# Altium schematic sheet 09 USB HUB.SchDoc
size A3; SheetNumber: 5; SheetTotal: 10
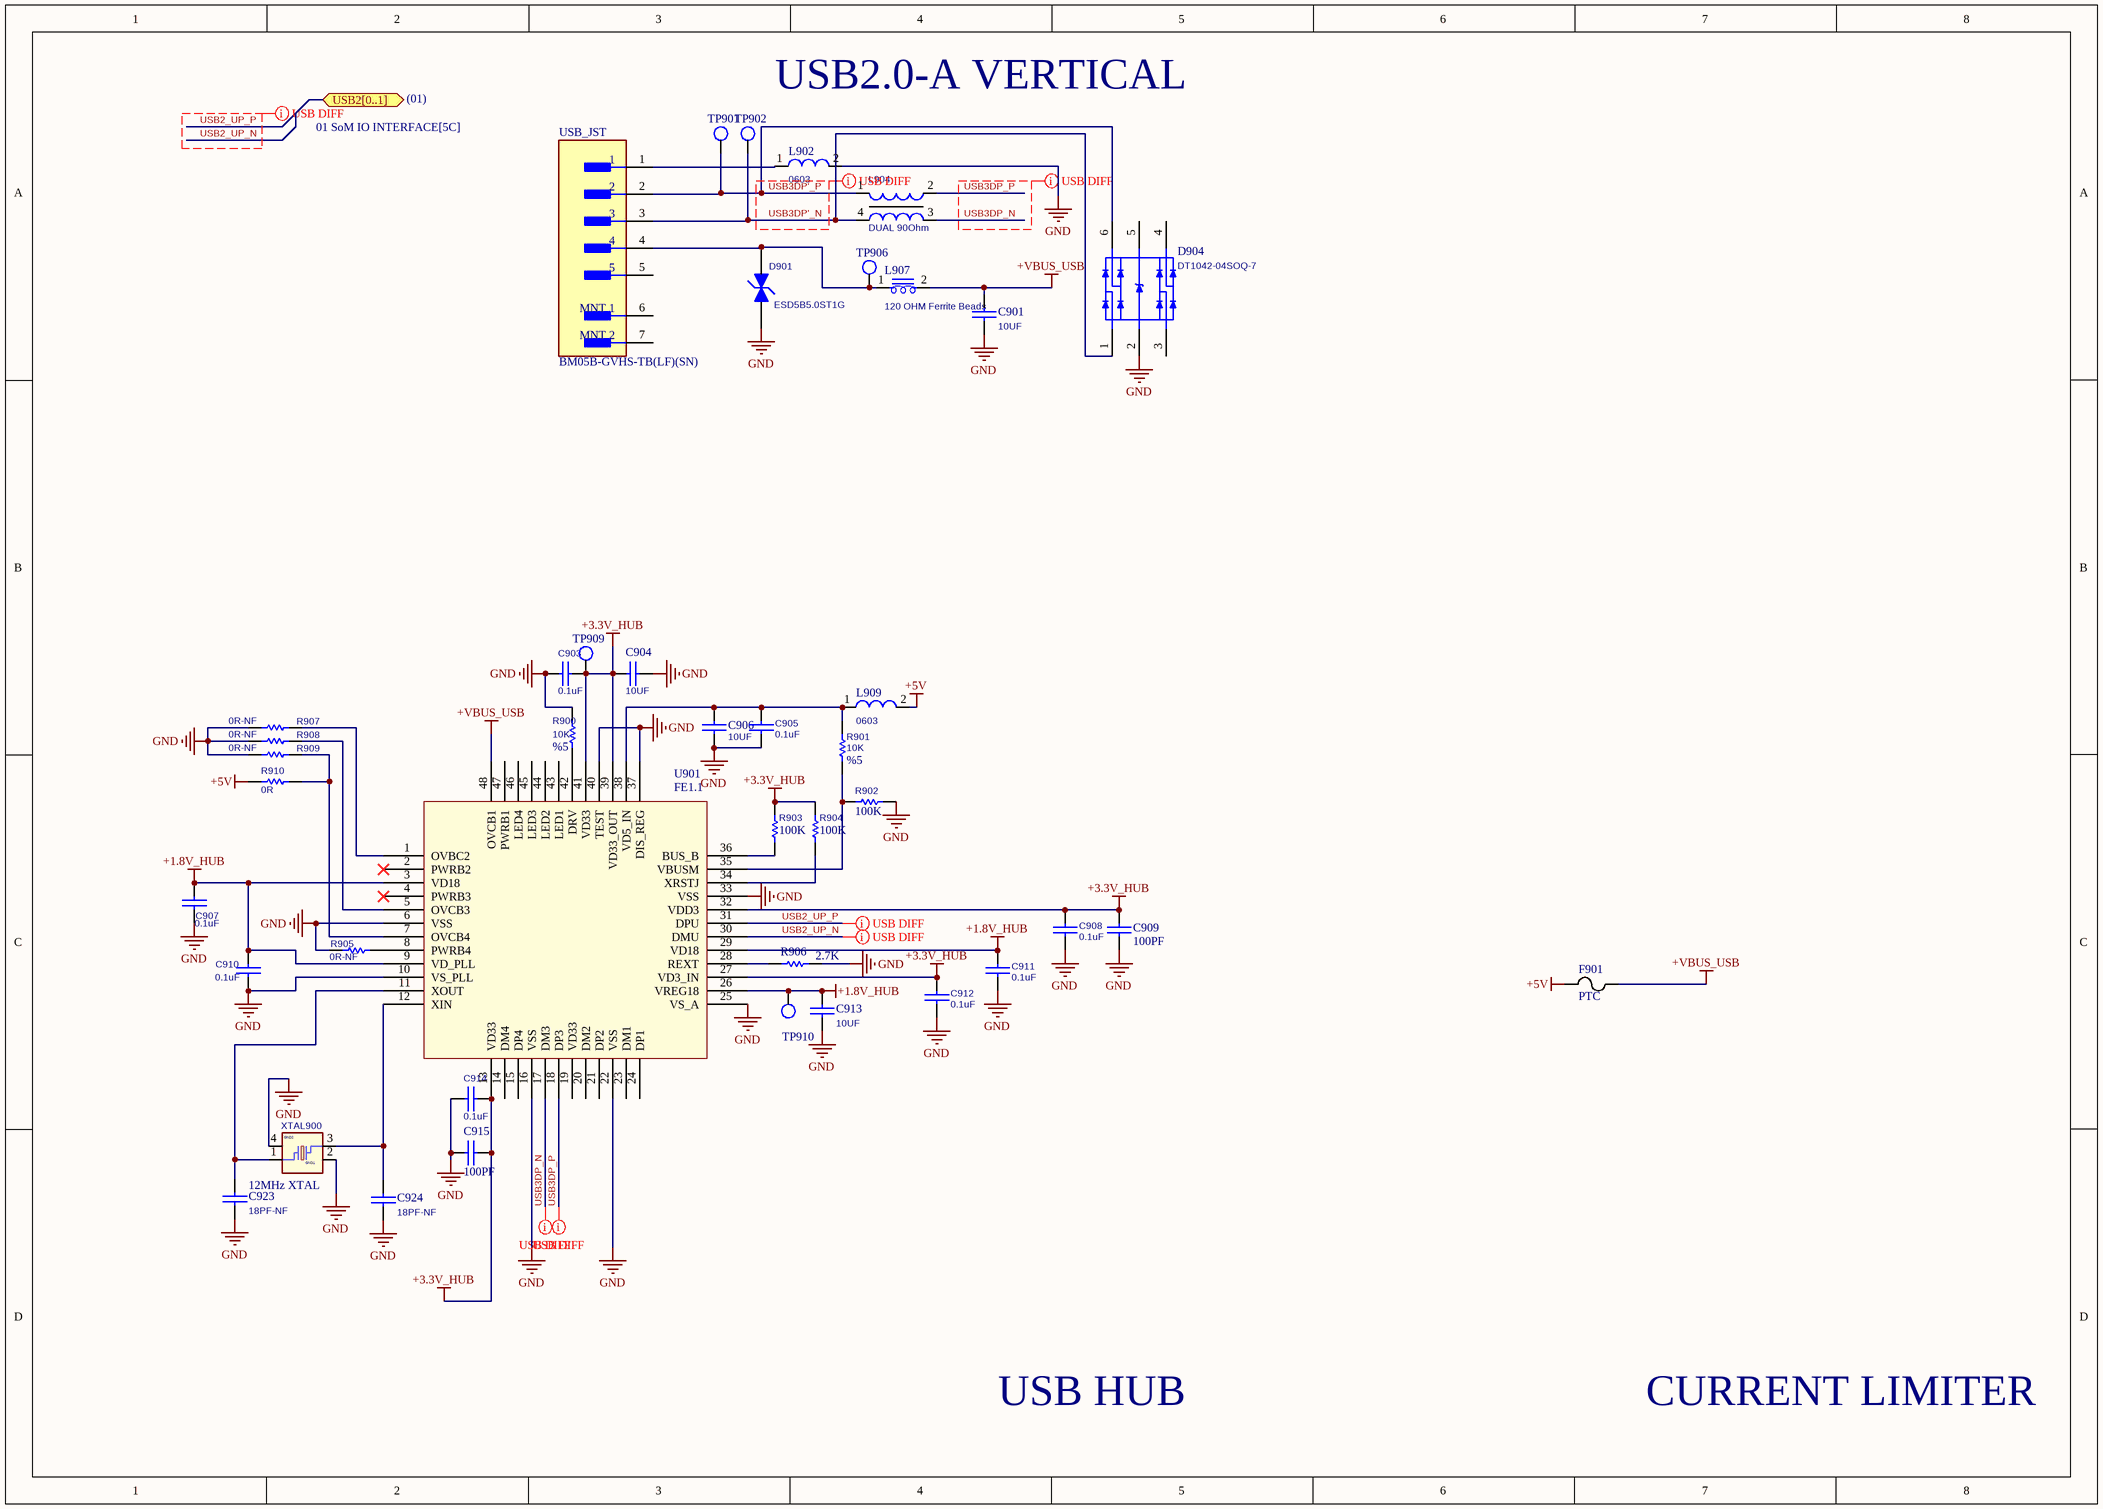
[diagram p0: 09 USB HUB.SchDoc]

## Parts
C901  10UF  [0805]
C903  0.1uF  [0402_CC]
C904  10UF  [0805]
C905  0.1uF  [0402_CC]
C906  10UF  [0805]
C907  0.1uF  [0402_CC]
C908  0.1uF  [0402_CC]
C909  100PF  [0402_CC]
C910  0.1uF  [0402_CC]
C911  0.1uF  [0402_CC]
C912  0.1uF  [0402_CC]
C913  10UF  [0805]
C914  0.1uF  [0402_CC]
C915  100PF  [0402_CC]
C923  18PF-NF  [0402_CC]  (no BOM)
C924  18PF-NF  [0402_CC]  (no BOM)
D901  ESD5B5.0ST1G  [SOD523 - SZESD]
D904  DT1042-04SOQ-7  [DIODE-DT1042-04SOQ-7]
F901  PTC  [1812]
L902  0603  [0603_RES]
L904  DUAL 90Ohm  [DLW21H]
L907  120 OHM Ferrite Beads  [0603_RES]
L909  0603  [0603_RES]
R900  10K  Tolerance: %5  [0402_RES]
R901  10K  Tolerance: %5  [0402_RES]
R902  100K  [0402_RES]
R903  100K  [0402_RES]
R904  100K  [0402_RES]
R905  0R-NF  [0402_RES]  (no BOM)
R906  2.7K  [0402_RES]
R907  0R-NF  [0402_RES]  (no BOM)
R908  0R-NF  [0402_RES]  (no BOM)
R909  0R-NF  [0402_RES]  (no BOM)
R910  0R  [0402_RES]
TP901  TEST POINT 15  [testpoint_15]  (value not drawn)  (no BOM)
TP902  TEST POINT 15  [testpoint_15]  (value not drawn)  (no BOM)
TP906  TEST POINT 15  [testpoint_15]  (value not drawn)  (no BOM)
TP909  TEST POINT 15  [testpoint_15]  (value not drawn)  (no BOM)
TP910  TEST POINT 15  [testpoint_15]  (value not drawn)  (no BOM)
U901  FE1.1  [LQFP48]
USB_JST  BM05B-GVHS-TB(LF)(SN)  [FP-BM05B-GVHS-TB_LF_SN-MFG]
XTAL900  CRYSTAL 12.MHZ 18PF SMD  [XTLOSC4_3P2X2P5MM_SM]  (value not drawn)

## Ports
USB2[0..1] (bidir, see 01 SoM IO INTERFACE[5C])

## Nets
+1.8V_HUB: C907.1 C910.1 C911.2 C913.1 TP910.1 U901.3(VD18) U901.9(VD_PLL) U901.26(VREG18) U901.29(VD18)
+3.3V_HUB: C903.1 C904.1 C908.2 C909.2 C912.2 C914.2 C915.2 R903.2 R904.2 TP909.1 U901.13(VD33) U901.27(VD3_IN) U901.32(VDD3) U901.39(VD33_OUT) U901.41(VD33)
+5V: F901.1 L909.2 R910.2
+VBUS_USB: C901.1 F901.2 L907.2 U901.48(OVCB1)
GND: C901.2 C903.2 C904.2 C905.1 C906.1 C907.2 C908.1 C909.1 C910.2 C911.1 C912.1 C913.2 C914.1 C915.1 C923.2 C924.2 D901.1(A) D904.2(VSS) L902.2 R900.1 R902.1 R905.1 R906.2 R907.1 R908.1 R909.1 U901.6(VSS) U901.10(VS_PLL) U901.16(VSS) U901.22(VSS) U901.25(VS_A) U901.33(VSS) U901.37(DIS_REG) U901.40(TEST) XTAL900.2(GND1) XTAL900.4(GND2)
USB2_UP_N: U901.30(DMU)
USB2_UP_P: U901.31(DPU)
USB3DP'_N: D904.1(IO1) L904.4 TP902.1 USB_JST.3
USB3DP'_P: D904.6(IO4) L904.1 TP901.1 USB_JST.2
USB3DP_N: L904.3 U901.17(DM3)
USB3DP_P: L904.2 U901.18(DP3)
NetC905_2: C905.2 C906.2 L909.1 R901.2 U901.38(VD5_IN)
NetC923_1: C923.1 U901.11(XOUT) XTAL900.1
NetC924_1: C924.1 U901.12(XIN) XTAL900.3
NetD901_2: D901.2(K) L907.1 TP906.1 USB_JST.4
NetL902_1: L902.1 USB_JST.1
NetR900_2: R900.2 U901.42(DRV)
NetR901_1: R901.1 R902.2 U901.35(VBUSM)
NetR903_1: R903.1 U901.36(BUS_B)
NetR904_1: R904.1 U901.34(XRSTJ)
NetR905_2: R905.2 U901.8(PWRB4)
NetR906_1: R906.1 U901.28(REXT)
NetR907_2: R907.2 U901.1(OVBC2)
NetR908_2: R908.2 U901.5(OVCB3)
NetR909_2: R909.2 R910.1 U901.7(OVCB4)

Not connected (* = marked no-connect by the designer): D904 3(IO2) 4(IO3) 5(VCC); U901 2(PWRB2)* 4(PWRB3)* 14(DM4) 15(DP4) 19(VD33) 20(DM2) 21(DP2) 23(DM1) 24(DP1) 43(LED1) 44(LED2) 45(LED3) 46(LED4) 47(PWRB1); USB_JST 5 6(MNT_1) 7(MNT_2)

## Layout directives
differential pair; differential pair class USB 90 OHM DIFF; net class USB: USB2_UP_N, USB2_UP_P, USB3DP'_N, USB3DP'_P, USB3DP_N, USB3DP_P
differential pair; differential pair class USB 90 OHM DIFF; net class USB; net class USB: USB3DP_N, USB3DP_P

## Notes on the sheet
- (01)
- USB2.0-A VERTICAL
- 12MHz XTAL
- USB HUB
- CURRENT LIMITER
- Sheet Title:
- Inventron
- Size:
- Drawn By:
- Revision:
- Project:
- Checked By:
- A4
- Sheet
- of
- Budotek Teknopark
- Dudullu OSB
- Des 2. Cadde No:8/30
- Umraniye / ISTANBUL
- Electronics and Software
- Date:
- Time:
- ©2020 Inventron Electronics and Software. All rights reserved.

## Library data of the parts
C901 C904 C906 C913 = CAP-CL21A106KOQNNNG: CAP CER 10UF 16V X5R 0805; Manufacturer-1: SAMSUNG; Class: Capacitor; Manufacturer Part Number-1: CL21A106KOQNNNG; Footprint: *; Manufacturer-2: *; Manufacturer Part Number-2: *; Inventron Stock No: *; Created By: EE; Created Date: *; Checked By: *; ASSY_OPT: *; Dimensions: *; Unit Price: 0.01876; Revision Date/Note: *; Price Break: 3000; Opt. Temp.: *; Features: *
C903 C905 C907 C908 C910-C912 C914 = CAP-CL05B104KO5NNNC: CAP VER 0.1UF 16V X7R 0402; Manufacturer-1: SAMSUNG; Opt. Temp.: -55/+125; Class: Capacitor; Manufacturer Part Number-1: CL05B104KO5NNNC; Footprint: 0402; Manufacturer-2: *; Manufacturer Part Number-2: *; Inventron Stock No: *; Created By: LA; Created Date: 23.11.2018; Checked By: *; ASSY_OPT: *; Dimensions: *; Unit Price: 0,00499; Revision Date/Note: *; Price Break: 10K
C909 C915 = CAP-CC0402JRNPO9BN101: CAP CER 100PF 50V C0G/NPO 0402; Manufacturer-1: Yageo; Class: Capacitor; Manufacturer Part Number-1: CC0402JRNPO9BN101; Footprint: *; Manufacturer-2: *; Manufacturer Part Number-2: *; Inventron Stock No: *; Created By: *; Created Date: *; Checked By: *; ASSY_OPT: *; Dimensions: *; Unit Price: *; Revision Date/Note: *; Price Break: *; Opt. Temp.: *; Features: *
C923 C924 = CAP-GCM1555C1H180JA16D: CAP CER 18PF 50V C0G/NP0 0402; Manufacturer-1: Murata Electronics; Class: Capacitor; Manufacturer Part Number-1: GCM1555C1H180JA16D; Footprint: *; Manufacturer-2: *; Manufacturer Part Number-2: *; Inventron Stock No: *; Created By: *; Created Date: *; Checked By: *; ASSY_OPT: *; Dimensions: *; Unit Price: *; Revision Date/Note: *; Price Break: *; Opt. Temp.: *; Features: *
D901 = DIODE-ESD5B5.0ST1G: VS DIODE 5V SOD523; Manufacturer-1: ON Semiconductor; Opt. Temp.: -55/+150; Manufacturer Part Number-1: ESD5B5.0ST1G; Footprint: SOD-523; Manufacturer-2: *; Manufacturer Part Number-2: *; Inventron Stock No: *; Created By: E.E; Created Date: 3.11.2020; Checked By: *; ASSY_OPT: *; Dimensions: *; Unit Price: 0,0129; Revision Date/Note: *; Price Break: 3000; Class: Diode; Features: AUTOMOTIVE
D904 = DIODE-DT1042-04SOQ-7: HDMI TVS DIODE; Manufacturer-1: Diodes Incorporated; Opt. Temp.: -55°C ~ 85°C (TA); Manufacturer Part Number-1: DT1042-04SOQ-7; Footprint: SOT26; Manufacturer-2: *; Manufacturer Part Number-2: *; Inventron Stock No: *; Created By: E.E; Created Date: 23.10.2020; Checked By: *; ASSY_OPT: *; Dimensions: *; Unit Price: 0.07575; Revision Date/Note: *; Price Break: 3000; Class: Diode
F901 = FUSE-KMC5S110RY33: THERMISTOR PTC RESETTABLE FUSE 1206 1100mA 33V 1812; Manufacturer-1: THINKING; Manufacturer Part Number-1: KMC5S110RY33; Manufacturer-2: *; Manufacturer Part Number-2: *; Inventron Stock No: *; Created By: EE; Created Date: *; Checked By: *; ASSY_OPT: *; Dimensions: *; Unit Price: 0.083; Revision Date/Note: *; Price Break: 4000; Opt. Temp.: *; Class: FUSE
L902 L909 = IND-FERRITE (RES 0 OHM) 0603: 0OHM 0603; Manufacturer Part Number-1: RC0603JR-070RL; Manufacturer-1: YAGEO; Class: Inductor; Footprint: 0603; Manufacturer-2: *; Inventron Stock No: *; Created By: EE; Checked By: *; ASSY_OPT: *; Dimensions: *; Revision Date/Note: *
L904 = IND-DLW21HN900SQ2L: Common Mode Chokes Dual 90Ohm 100MHz 0.33A 0.35Ohm DCR SMD T/R; Manufacturer-1: Murata Manufacturing; Class: Inductor; Manufacturer Part Number-1: DLW21HN900SQ2L; Footprint: *; Manufacturer-2: *; Manufacturer Part Number-2: *; Inventron Stock No: *; Created By: E.E; Created Date: 2.11.2020; Checked By: *; ASSY_OPT: *; Dimensions: *; Unit Price: 0.185; Revision Date/Note: *; Price Break: 3000; Opt. Temp.: *; Features: *
L907 = IND-BLM18PG121SH1D: Ferrite Beads Multi-Layer 120Ohm 25% 100MHz 2A 0.05Ohm DCR 0603 Automotive T/R; Manufacturer-1: Murata Manufacturing; Class: Inductor; Manufacturer Part Number-1: BLM18PG121SH1D; Footprint: 0603; Manufacturer-2: *; Manufacturer Part Number-2: *; Inventron Stock No: *; Created By: E.E; Created Date: 2.11.2020; Checked By: *; ASSY_OPT: *; Dimensions: *; Unit Price: 0.02550; Revision Date/Note: *; Price Break: 4000; Opt. Temp.: *; Features: *
R900 R901 = RES-RMCF0402JT10K0: RES 10K OHM 5% 1/16W 0402; Manufacturer-1: STACKPOLE; Opt. Temp.: -55/+155; Class: Resistor; Manufacturer Part Number-1: RMCF0402JT10K0; Footprint: 0402; Manufacturer-2: *; Manufacturer Part Number-2: *; Inventron Stock No: *; Created By: LA; Created Date: 23.11.2018; Checked By: *; ASSY_OPT: *; Dimensions: *; Unit Price: 0,00127; Revision Date/Note: *; Price Break: 10K
R902-R904 = RES-RMCF0402JT100K: RES 100K OHM 5% 1/16W 0402; Manufacturer-1: STACKPOLE; Opt. Temp.: -55/+155; Class: Resistor; Tolerance: %5; Manufacturer Part Number-1: RMCF0402JT100K; Footprint: 0402; Manufacturer-2: *; Manufacturer Part Number-2: *; Inventron Stock No: *; Created By: LA; Created Date: 23.11.2018; Checked By: *; ASSY_OPT: *; Dimensions: *; Unit Price: 0,00127; Revision Date/Note: *; Price Break: 10K; Features: AUTOMOTIVE
R905 R907-R910 = RES-RMCF0402ZT0R00: RES 0 OHM JUMPER 1/16W 0402; Manufacturer-1: STACKPOLE; Opt. Temp.: -55/+155; Class: Resistor; Manufacturer Part Number-1: RMCF0402ZT0R00; Footprint: 0402; Manufacturer-2: *; Manufacturer Part Number-2: *; Inventron Stock No: *; Created By: LA; Created Date: 23.11.2018; Checked By: *; ASSY_OPT: *; Dimensions: *; Unit Price: 0,00127; Revision Date/Note: *; Price Break: 10K
R906 = RES-RMCF0402FT2K70: RES SMD 2.7K OHM 1% 1/16W 0402; Manufacturer-1: Yageo; Class: Resistor; Manufacturer Part Number-1: RMCF0402FT2K70; Footprint: 0402; Manufacturer-2: *; Manufacturer Part Number-2: *; Inventron Stock No: *; Created By: EE; Created Date: *; Checked By: *; ASSY_OPT: *; Dimensions: *; Unit Price: *; Revision Date/Note: *; Price Break: *; Opt. Temp.: *; Tolerance: *
U901 = IC-FE1.1-AQFP48A: IC 4XCH USB Hub Controller USB 2.0 USB Interface 48-QFP (7x7); Manufacturer-1: TERMINUS; Class: ICs; Manufacturer Part Number-1: FE1.1-AQFP48A; Footprint: 48 LQFP; Manufacturer-2: *; Manufacturer Part Number-2: *; Inventron Stock No: *; Created By: OKS; Created Date: 03.06.2022; Checked By: *; ASSY_OPT: *; Dimensions: *; Unit Price: 1.05; Revision Date/Note: *; Price Break: 5000; Opt. Temp.: *
USB_JST = CMP-17439-000129-1: CONN HEADER SMD 5POS 1.25MM; Number of Positions: 5; Mated Stacking Heights: 8.8mm; Voltage Rating: 50V; Pitch: 0.049inch; Contact Plating: Tin; Fastening Type: Latch; Insulation Material: Nylon; Contact Type: Outer Shroud Contact; Color: Natural; Contact Shape: Rectangular; Flammability Rating: UL94 V-0; Packaging: Cut Tape; Number of Rows: 1; Contact Finish - Mating: TIN; Termination: Solder; Max Operating Temperature: 85°C; Series: GVH; Min Operating Temperature: -25°C; Mount: Surface Mount; Connector Type: Header; Insulation Color: Natural; Contact Material: Bronze
XTAL900 = XTAL-FA-238V 12.0000MB50X-C0: CRYSTAL 12.0000MHZ 18PF SMD; Manufacturer-1: EPSON; Opt. Temp.: +40/+85; Manufacturer Part Number-1: FA-238V 12.0000MB50X-C0; Footprint: 4-SMD; Manufacturer-2: *; Manufacturer Part Number-2: *; Inventron Stock No: *; Created By: E.E; Created Date: 20.10.2020; Checked By: *; ASSY_OPT: *; Dimensions: *; Unit Price: 0.6; Revision Date/Note: *; Price Break: 1K; Class: Crystal